# EAGLE design tgs2611-c00-v3 (EAGLE 9.6.2)
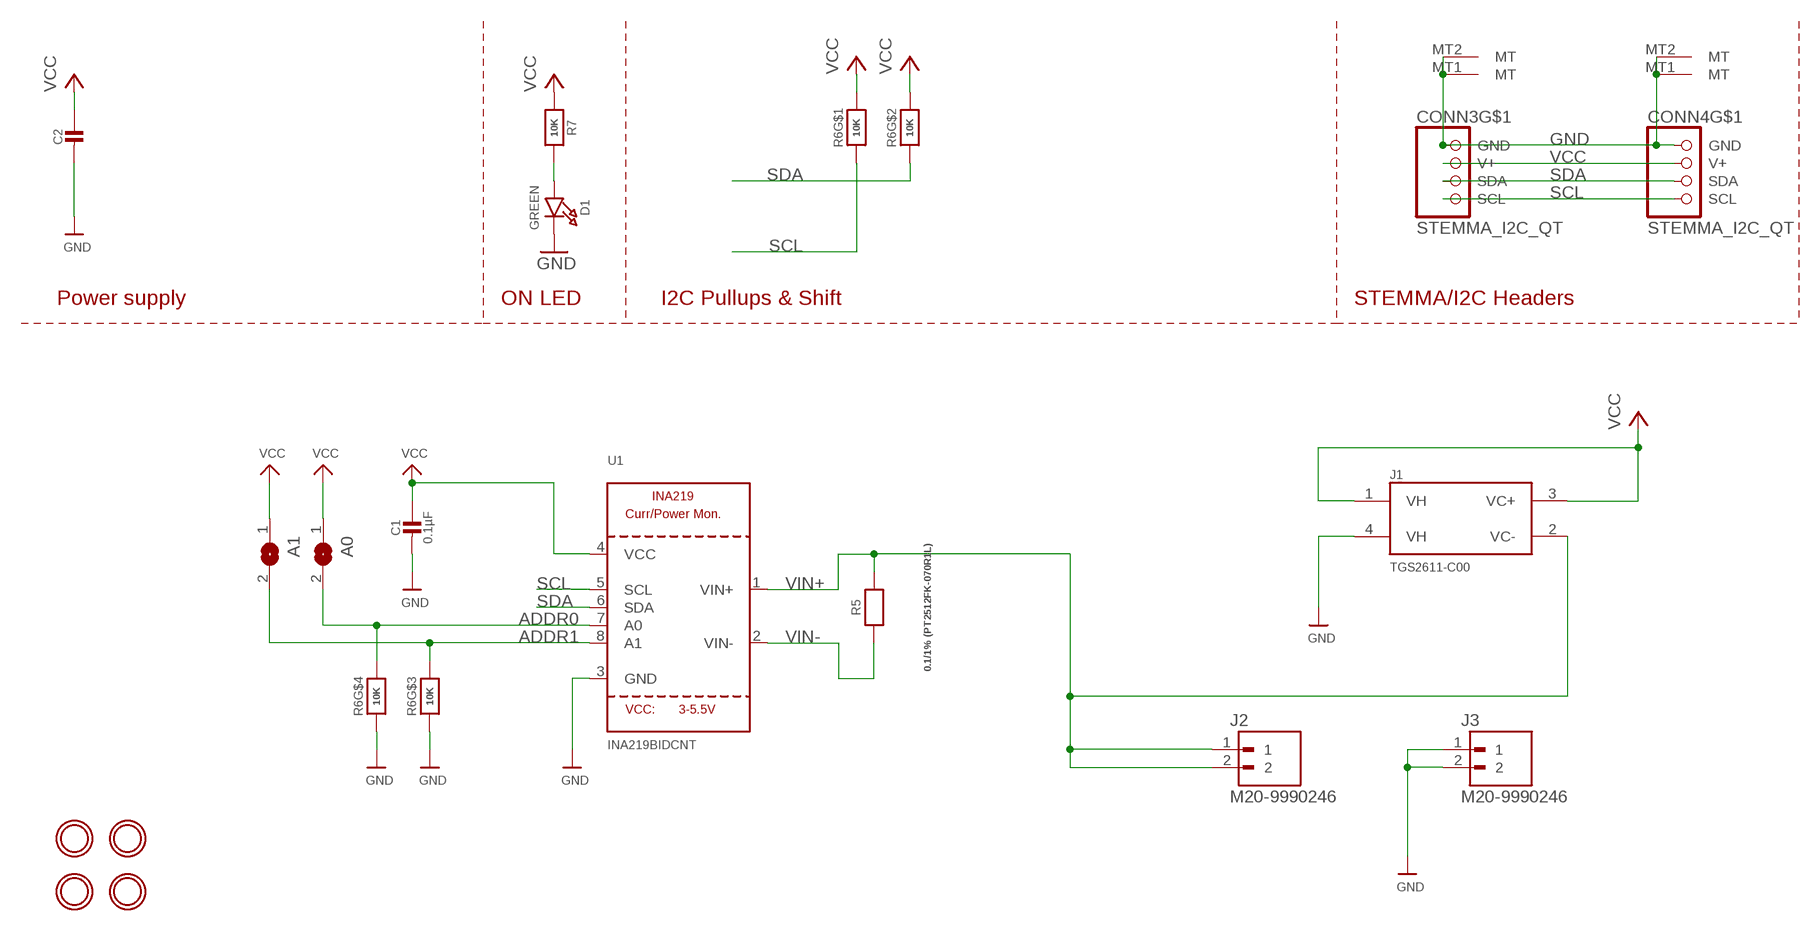
[diagram p0: schematic, sheet 1]

## Parts
A0  SOLDERJUMPERREFLOW_NOPASTE  [SOLDERJUMPER_REFLOW_NOPASTE]
A1  SOLDERJUMPERREFLOW_NOPASTE  [SOLDERJUMPER_REFLOW_NOPASTE]
C1  0.1µF  CAP_CERAMIC0603_NO  [0603-NO]
C2  10uF  CAP_CERAMIC0805-NOOUTLINE  [0805-NO]
CONN3  STEMMA_I2C_QT  [JST_SH4]
CONN4  STEMMA_I2C_QT  [JST_SH4]
D1  GREEN  LED0603_NOOUTLINE  [CHIPLED_0603_NOOUTLINE]
J1  TGS2611-C00  [TO180P920X780-4P]
J2  M20-9990246  [HARWIN_M20-9990246]
J3  M20-9990246  [HARWIN_M20-9990246]
R5  0.1/1% (PT2512FK-070R1L)  RESISTOR2512  [2512]
R6  10K  RESISTOR_4PACK  [RESPACK_4X0603]
R7  10K  RESISTOR_0603_NOOUT  [0603-NO]
U1  INA219BIDCNT  INA219  [SOT23-8]
U$20  MOUNTINGHOLE2.5  [MOUNTINGHOLE_2.5_PLATED]
U$21  MOUNTINGHOLE2.5  [MOUNTINGHOLE_2.5_PLATED]
U$25  MOUNTINGHOLE2.5  [MOUNTINGHOLE_2.5_PLATED]
U$27  MOUNTINGHOLE2.5  [MOUNTINGHOLE_2.5_PLATED]

## Nets
ADDR0: A0.2 R6.5 U1.7(A0)
ADDR1: A1.2 R6.6 U1.8(A1)
GND: C1.2 C2.2 CONN3.1(GND) CONN3.MT1(MT) CONN3.MT2(MT) CONN4.1(GND) CONN4.MT1(MT) CONN4.MT2(MT) D1.C J1.4(VH) J3.1 J3.2 R6.3 R6.4 U1.3(GND)
N$3: D1.A R7.2
SCL: CONN3.4(SCL) CONN4.4(SCL) R6.1 U1.5(SCL)
SDA: CONN3.3(SDA) CONN4.3(SDA) R6.2 U1.6(SDA)
VCC: A0.1 A1.1 C1.1 C2.1 CONN3.2(V+) CONN4.2(V+) J1.1(VH) J1.3(VC+) R6.7 R6.8 R7.1 U1.4(VCC)
VIN+: J1.2(VC-) J2.1 J2.2 R5.2 U1.1(VIN+)
VIN-: R5.1 U1.2(VIN-)

## Notes on the sheet
- Power supply | ON LED | I2C Pullups & Shift | STEMMA/I2C Headers

## Library data of the parts
A0 A1 = microbuilder:SOLDERJUMPER: SMD Solder JUMPER Solder the two pads together to create a connection, or remove the solder to break it. REFLOW - Use this footprint for solder paste and reflow ovens. WAVE - Use this footprint for hand-soldering (larger pads). CLOSED - Has a trace between the two pads to ensure it is closed by default. The trace needs to be cut to disable the jumper, and can be closed again by creating a solder bridge between the two pads.
C1 C2 = microbuilder:CAP_CERAMIC: Ceramic Capacitors For new designs, use the packages preceded by an '_' character since they are more reliable: The following footprints should be used on most boards: _0402 - Standard footprint for regular board layouts _0603 - Standard footprint for regular board layouts _0805 - Standard footprint for regular board layouts _1206 - Standard footprint for regular board layouts For extremely tight-pitch boards where space is at a premium, the following 'micro-pitch' footprints can be used (smaller pads, no silkscreen outline, etc.): _0402MP - Micro-pitch footprint for very dense/compact boards _0603MP - Micro-pitch footprint for very dense/compact boards _0805MP - Micro-pitch footprint for very dense/compact boards _1206MP - Micro-pitch footprint for very dense/compact boards
CONN3 CONN4 = microbuilder:STEMMA_I2C
D1 = microbuilder:LED: LED 0603 - 0603 Surface Mount Package 2mA: Green LED - Low Power (3.9mcd, 2ma, 1.7Vf) - Digikey: 475-2709-2-ND Orange LED - Low Power (9.8mcd, 2ma, 1.8Vf) - Digikey: 475-1194-2-ND Red LED - Low Power (5mcd, 2ma, 1.8Vf) - Digikey: 475-1195-2-ND Yellow LED - Low Power (7mcd, 2ma, 1.8Vf) - Digikey: 475-1196-2-ND 5mA: Blue LED - Low Power (17mcd, 5ma, 2.9Vf) - Digikey: LNJ937W8CRACT-ND 0805 - 0805 Surface Mount Package 2mA: Red LED (8.8mcd, 2mA, 1.8Vf, Clear) - Low Power [Digikey: 475-2510-1-ND] Green LED (5mcd, 2mA, 1.8Vf, Clear) - Low Power [Digikey: 475-2730-1-ND] Yellow LED (11.3mcd, 2mA, 1.8Vf, Clear) - Low Power [Digikey: 475-2555-1-ND] 20mA: Red LED (104mcd, 20mA, Diffused) - LS R976 [Digikey: 475-1278-6-ND] Red LED (12mcd, 20mA, 2.0Vf, Clear) - APT2012EC [Digikey: 754-1128-1-ND] Green LED (15mcd, 20mA, 2.2Vf, Clear) - APT2012GC [Digikey: 754-1131-1-ND] Orange LED (160mcd, 20mA, 2.1Vf, Clear) - APT2012SECK [Digikey: 754-1130-1-ND] 1206 - 1206 Surface Mount Package Green LED (26mcd, 20mA, Diffused) - LG N971 [Digikey: 475-1407-6-ND] Red LED (15mcd, 20mA, Diffused) - LH N974 [Digikey: 475-1416-6-ND] Cree - Cree High-Power Surface Mount LEDs XPEBWT-L1-0000-00D50 - White 111lm 350mA 2.9Vf 6200K 110° XTEAWT-00-0000-00000LEE3 - White 114lm 350mA 2.85Vf 5000K 115° Everlight - Everlight 45-21 Series Surface Mount LEDs 45-21/QK2C-B2832AC2CB2/2T - Warm White 2000mcd 20mA 3.25Vf 3050K 120° 45-21/LK2C-B38452C4CB2/2T - Nuetral White 2000mcd 20mA 3.25Vf 4150K 120° 45-21/LK2C-B50634C6CB2/2T - Cold White 2200mcd 20mA 3.25Vf 5650K 120° PLCC2 Reverse Mount LS T77K-J1L2-1-0-2-R18-Z - Red 11.25mcd 2mA 1.8Vf 630nm 120° LO T77K-L1M2-24-Z - Orange 19.6mcd 2mA 1.8Vf 606nm 120° LY T77K-K2M1-26-Z - Yellow 15.7mcd 2mA 1.8Vf 587nm 120°
J1 = TGS2611-C00:TGS2611-C00: Methane, Natural Gas sensor, Check availability <https://pricing.snapeda.com/parts/TGS2611-C00/Figaro/view-part?ref=eda>; AVAILABILITY: Not in stock; CHECK_PRICES: https://www.snapeda.com/parts/TGS2611-C00/Figaro/view-part/?ref=eda; DESCRIPTION: Gas Sensor 4-Pin TO-5; MF: Figaro; MP: TGS2611-C00; PACKAGE: None; PRICE: None; SNAPEDA_LINK: https://www.snapeda.com/parts/TGS2611-C00/Figaro/view-part/?ref=snap
J2 J3 = M20-9990246:M20-9990246; MANUFACTURER: Harwin; MAXIMUM_PACKAGE_HEIGHT: 9.64mm; PARTREV: 14; STANDARD: Manufacturer Recommendations
R5 R7 = microbuilder:RESISTOR: Resistors For new designs, use the packages preceded by an '_' character since they are more reliable: The following footprints should be used on most boards: _0402 - Standard footprint for regular board layouts _0603 - Standard footprint for regular board layouts _0805 - Standard footprint for regular board layouts _1206 - Standard footprint for regular board layouts For extremely tight-pitch boards where space is at a premium, the following 'micro-pitch' footprints can be used (smaller pads, no silkscreen outline, etc.): _0402MP - Micro-pitch footprint for very dense/compact boards _0603MP - Micro-pitch footprint for very dense/compact boards _0805MP - Micro-pitch footprint for very dense/compact boards _1206MP - Micro-pitch footprint for very dense/compact boards
R6 = microbuilder:RESISTOR_4PACK: Resistor Packs (4 resistors) 4 x 0603 10K 1/16W - Digikey: YC164J-10KCT-ND
U1 = microbuilder:INA219: INA219 - I2C Current/Power Monitor Voltage Range: 0-26V Accuracy: 0.5% Temperature: -40°C - 125°C
U$20 U$21 U$25 U$27 = microbuilder:MOUNTINGHOLE: Mounting Hole For #2 screws (0.086"/2.18mm width, 0.094"/2.4mm hole) use 2.5mm; BOM: EXCLUDE

## Net classes
1 highpower: width 0.305 mm, drill 0.483 mm
2 lowpower: width 0.254 mm, drill 0.483 mm

## Board
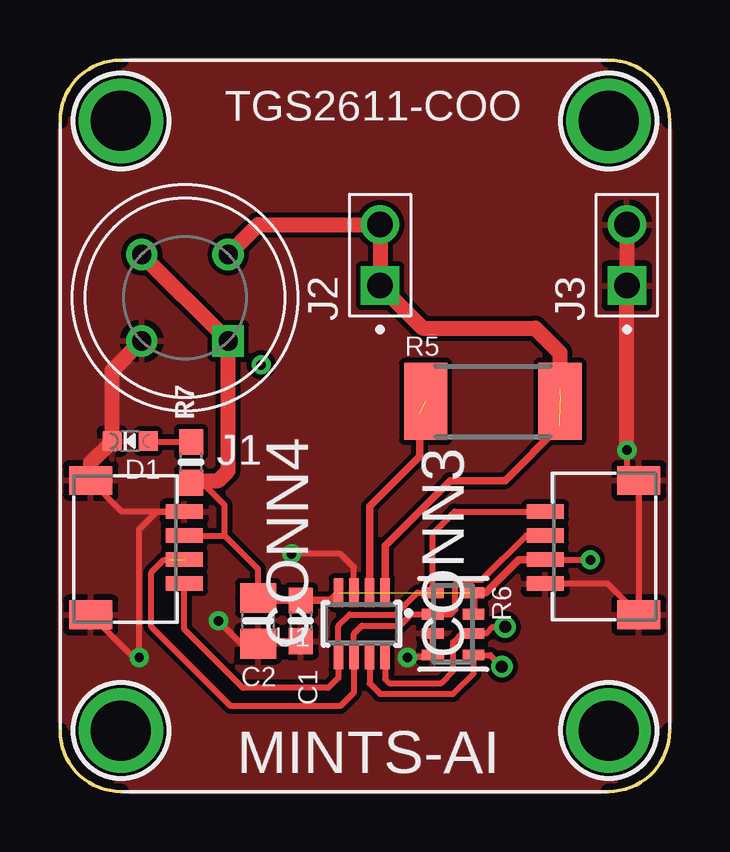
[diagram p1: board, top side]
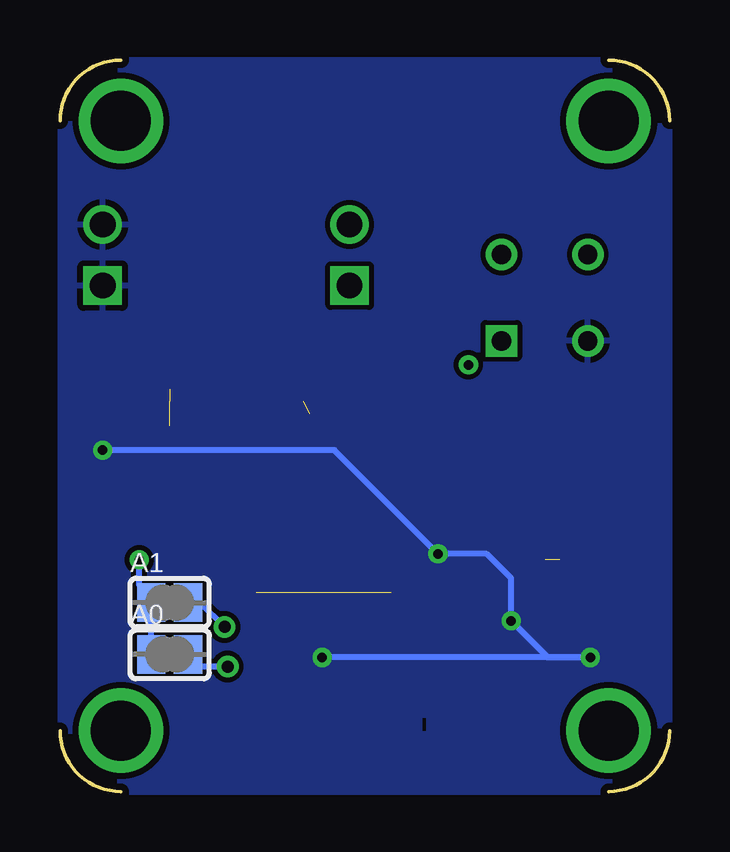
[diagram p2: board, bottom side, seen from below]

Size 25.4 x 30.48 mm. Coordinates in mm from the lower left corner, seen from the top.
Outline: 0,27.94 arc-90 2.54,30.48
Outline: 22.86,30.48 arc-90 25.4,27.94
Outline: 0,2.54 arc90 2.54,0
Outline: 22.86,0 arc90 25.4,2.54
Copper layers (1*16): Top 0.035mm / dielectric 1.5mm / Bottom 0.035mm
Design rules "adafruit 7-7": minimum track width 6mil, minimum drill 15.5mil, track to track 8mil, track to pad 7mil, pad to pad 7mil, via to via 7mil, smd to smd 7mil, copper to edge 10mil, drill to drill 8mil, minimum pad ring 10mil, minimum via ring 8mil, stop-mask expansion 2mil, vias tented up to drill 20mil, thermal gap 10mil
bRestrict: area 10.2,2.5 to 10.3,3

### Footprints (pad centres in the part's own frame; a part is rotated, then mirrored left to right if it is on the bottom)
SOLDERJUMPER_REFLOW_NOPASTE = smd 1.168 x 1.6: 1 -0.762,0; 2 0.762,0
0603-NO = smd 1.075 x 1: 1 -0.85,0; 2 0.85,0
0805-NO = smd 1.24 x 1.5: 1 -0.95,0; 2 0.95,0
JST_SH4 = smd 0.6 x 1.55: 1 -1.5,2.514; 2 -0.5,2.514; 3 0.5,2.514; 4 1.5,2.514 | smd 1.2 x 1.8: MT1 -2.8,-1.386; MT2 2.8,-1.386
CHIPLED_0603_NOOUTLINE = smd 0.8 x 0.8: A 0,-0.75; C 0,0.75
TO180P920X780-4P = drill 0.8 square: 1 -1.8,1.8 | drill 0.8: 2 -1.8,-1.8; 3 1.8,-1.8; 4 1.8,1.8
HARWIN_M20-9990246 = drill 1.07 square: 1 -1.27,0 | drill 1.07: 2 1.27,0
2512 = smd 1.8 x 3.2: 1 -2.8,0; 2 2.8,0
RESPACK_4X0603 = smd 0.45 x 0.9: 1 -1.3,-0.85; 2 -0.4,-0.85; 3 0.4,-0.85; 4 1.3,-0.85; 5 1.3,0.85; 6 0.4,0.85; 7 -0.4,0.85; 8 -1.3,0.85
SOT23-8 = smd 0.4 x 1.2: 1 -0.975,-1.3; 2 -0.325,-1.3; 3 0.325,-1.3; 4 0.975,-1.3; 5 0.975,1.3; 6 0.325,1.3; 7 -0.325,1.3; 8 -0.975,1.3
MOUNTINGHOLE_2.5_PLATED = drill 2.5 pad 3.2: P$1 0,0

### Placement (x,y rotation side)
A0  20.83,5.71 0 bottom
A1  20.83,7.87 0 bottom
C1  10.03,7.11 270 top
C2  8.26,7.11 270 top
CONN3  22.73,10.16 90 top
CONN4  2.67,10.16 270 top
D1  2.92,14.61 90 top
J1  5.21,20.57 180 top
J2  13.34,22.35 90 top
J3  23.62,22.35 90 top
R5  18.03,16.26 0 top
R6  16.38,6.99 270 top
R7  5.46,13.72 90 top
U1  12.57,6.99 180 top
U$20  2.54,27.94 0 top
U$21  22.86,27.94 0 top
U$25  2.54,2.54 0 top
U$27  22.86,2.54 0 top

### Tracks (layer width: path | path; a pad name or v marks a point on that pad's centre or on a via)
ADDR0  (via drill 0.5)
  Top 0.254: U1.7 12.9,4.5 13.34,4.06 16.37,4.06 17.23,4.92 R6.5 17.94,5.68 v18.41,5.21
  Bottom 0.254: A0.2 19.56,5.21 v18.41,5.21
ADDR1  (via drill 0.5)
  Top 0.254: U1.8 13.55,4.69 13.72,4.52 15.88,4.52 16.38,5.03 16.38,6.22 16.75,6.58 R6.6 17.74,6.58 17.75,6.58 18.03,6.86 v18.54,6.86
  Bottom 0.254: v18.54,6.86 19.56,7.87 A1.2
GND  (via drill 0.39)
  Top 0.254: C1.2 8.36,6.26 C2.2 7.55,6.16 v6.6,7.11 | CONN4.MT2 3.05,5.59 v3.3,5.59 3.3,10.92 4.04,11.66 CONN4.1 2.58,11.66 CONN4.MT1 | U1.3 12.25,9.34 11.68,9.91 v9.65,9.91 | v14.48,5.59 15.44,5.59 R6.4 R6.3 | v23.62,14.22 v23.61,14.21 23.61,13.47 CONN3.MT2 CONN3.MT1 22.82,8.66 CONN3.1
  Top 0.635: CONN4.MT1 1.28,13.71 D1.C 2.17,17.54 J1.4 | v23.62,14.22 J3.1 J3.2
  Bottom 0.254: v14.48,5.59 v3.3,5.59 5.08,5.59 v6.6,7.11 6.6,8.89 7.62,9.91 v9.65,9.91 13.97,14.22 v23.62,14.22
  pour Top: 0,30.48 25.4,30.48 25.4,0 0,0
  pour Bottom: 0,30.48 25.4,30.48 25.4,0 0,0
N$1  (via drill 0.39)
  other vias: 8.38,17.78
N$3
  Top 0.254: D1.A 3.71,14.57 R7.2
SCL
  Top 0.254: CONN3.4 16.44,11.66 15.53,10.75 R6.1 14.89,8.29 13.97,7.37 12.06,7.37 11.6,6.9 U1.5 11.6,4.74 11.18,4.32 7.62,4.32 5.18,6.76 CONN4.4
SDA  (1 unrouted)
  Top 0.254: CONN3.3 19.42,10.66 17.58,8.81 16.66,8.81 16.48,8.64 16.48,7.59 16.27,7.38 R6.2 14.64,7.38 14.16,6.91 12.57,6.91 12.25,6.58 U1.6 12.25,4.12 11.68,3.56 7.11,3.56 3.81,6.86 3.81,9.14 4.32,9.65 4.57,9.65
VCC  (via drill 0.39)  (1 unrouted)
  Top 0.254: 5.84,12.87 5.93,12.87 6.86,11.94 6.86,10.67 6.87,10.66 | C2.1 8.26,9.27 6.87,10.66 | CONN4.2 6.87,10.66 | CONN3.2 v22.09,9.66 v22.1,9.65
  Top 0.305: U1.4 11.28,7.96 C1.1 8.36,7.96 C2.1 | R6.7 R6.8 17.73,8.29 19.11,9.66 CONN3.2
  Top 0.381: C2.1 7.69,8.06
  Top 0.635: J1.3 J1.1 7.01,13.36 6.6,12.95 5.55,12.95 R7.1 5.84,12.87
  Bottom 0.254: A0.1 A1.1 21.59,8.13 22.1,8.64 v22.1,9.65
VIN+  (2 unrouted)
  Top 0.305: U1.1 13.55,10.25 16.26,12.95 18.54,12.95 20.83,15.24
  Top 0.635: J1.2 8.26,23.62 J2.2 J2.1 15.11,19.3 19.81,19.3 20.83,18.29 20.83,16.76
VIN-  (1 unrouted)
  Top 0.305: 14.99,15.75 14.99,13.97 12.9,11.88 U1.2

### Text on the board
tPlace: TGS2611-COO | MINTS-AI